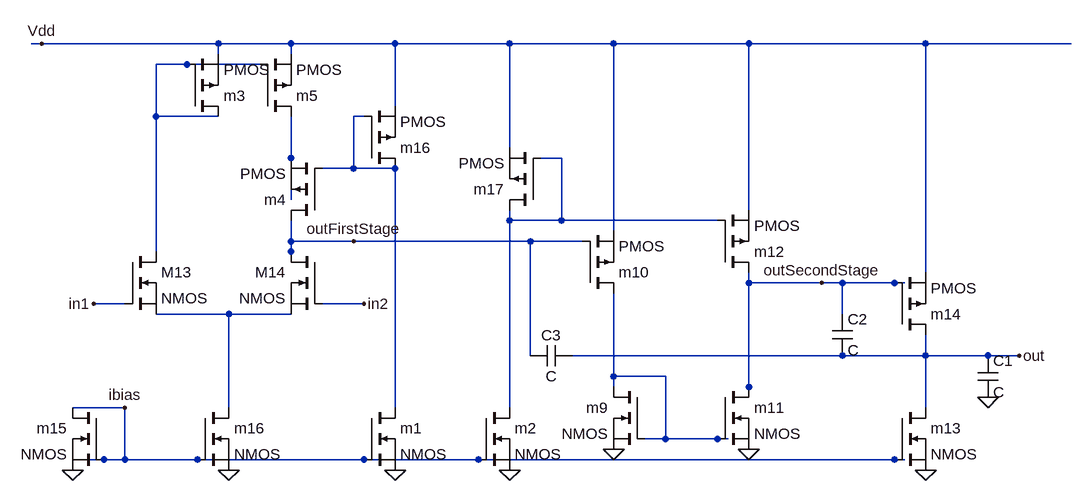
[diagram p0: schematic schematic_2.asc]
schematic_2.asc, the LTspice schematic file:
Version 4
SHEET 1 3804 1208
WIRE 1296 -144 1280 -144
WIRE 1568 -144 1296 -144
WIRE 1680 -144 1568 -144
WIRE 1840 -144 1680 -144
WIRE 2016 -144 1840 -144
WIRE 2176 -144 2016 -144
WIRE 2384 -144 2176 -144
WIRE 2656 -144 2384 -144
WIRE 2880 -144 2656 -144
WIRE 1568 -128 1568 -144
WIRE 1680 -128 1680 -144
WIRE 1520 -112 1472 -112
WIRE 1632 -112 1520 -112
WIRE 1840 -48 1840 -144
WIRE 1472 -32 1472 -112
WIRE 1568 -32 1472 -32
WIRE 1792 -32 1776 -32
WIRE 2016 16 2016 -144
WIRE 1680 32 1680 -32
WIRE 2096 32 2064 32
WIRE 1776 48 1776 -32
WIRE 1776 48 1728 48
WIRE 1840 48 1840 32
WIRE 1840 48 1776 48
WIRE 1680 96 1680 32
WIRE 2384 112 2384 -144
WIRE 2016 128 2016 112
WIRE 2096 128 2096 32
WIRE 2096 128 2016 128
WIRE 2336 128 2096 128
WIRE 2176 144 2176 -144
WIRE 1680 160 1680 128
WIRE 1776 160 1680 160
WIRE 2048 160 1776 160
WIRE 2128 160 2048 160
WIRE 1472 176 1472 -32
WIRE 1680 176 1680 160
WIRE 1680 192 1680 176
WIRE 2656 208 2656 -144
WIRE 2384 224 2384 208
WIRE 2496 224 2384 224
WIRE 2528 224 2496 224
WIRE 2608 224 2528 224
WIRE 2624 224 2608 224
WIRE 1424 256 1376 256
WIRE 1792 256 1728 256
WIRE 1584 272 1472 272
WIRE 1680 272 1584 272
WIRE 2528 272 2528 224
WIRE 2048 336 2048 160
WIRE 2528 336 2112 336
WIRE 2656 336 2656 304
WIRE 2656 336 2528 336
WIRE 2752 336 2656 336
WIRE 2800 336 2752 336
WIRE 2176 368 2176 240
WIRE 2256 368 2176 368
WIRE 2176 384 2176 368
WIRE 2384 384 2384 224
WIRE 2384 400 2384 384
WIRE 1424 416 1344 416
WIRE 1584 416 1584 272
WIRE 1840 416 1840 48
WIRE 2016 416 2016 128
WIRE 2656 416 2656 336
WIRE 2256 464 2256 368
WIRE 2256 464 2224 464
WIRE 2336 464 2256 464
WIRE 2352 464 2336 464
WIRE 1392 496 1344 496
WIRE 1424 496 1424 416
WIRE 1424 496 1392 496
WIRE 1536 496 1424 496
WIRE 1792 496 1536 496
WIRE 1968 496 1792 496
WIRE 2608 496 1968 496
WIRE 2624 496 2608 496
FLAG 2496 224 outSecondStage
FLAG 2800 336 out
FLAG 2656 512 0
FLAG 1376 256 in1
FLAG 1792 256 in2
FLAG 2176 480 0
FLAG 1776 160 outFirstStage
FLAG 1840 512 0
FLAG 2016 512 0
FLAG 2384 480 0
FLAG 1424 416 ibias
FLAG 1344 512 0
FLAG 1584 512 0
FLAG 2752 400 0
FLAG 1296 -144 Vdd
SYMBOL pmos 2608 304 M180
SYMATTR InstName m14
SYMBOL pmos 1728 128 R180
SYMATTR InstName m4
SYMBOL pmos 1520 -32 M180
SYMATTR InstName m3
SYMBOL pmos 1632 -32 M180
SYMATTR InstName m5
SYMBOL pmos 2064 112 R180
SYMATTR InstName m17
SYMBOL pmos 2128 240 M180
SYMATTR InstName m10
SYMBOL nmos 2608 416 R0
SYMATTR InstName m13
SYMBOL nmos 1424 176 R0
SYMATTR InstName M13
SYMBOL nmos 1728 176 M0
SYMATTR InstName M14
SYMBOL nmos 2224 384 M0
SYMATTR InstName m9
SYMBOL nmos 2336 384 R0
SYMATTR InstName m11
SYMBOL nmos 1392 416 M0
SYMATTR InstName m15
SYMBOL nmos 1536 416 R0
SYMATTR InstName m16
SYMBOL nmos 1968 416 R0
SYMATTR InstName m2
SYMBOL pmos 2336 208 M180
SYMATTR InstName m12
SYMBOL pmos 1792 48 M180
SYMATTR InstName m16
SYMBOL nmos 1792 416 R0
SYMATTR InstName m1
SYMBOL cap 2736 336 R0
SYMATTR InstName C1
SYMBOL cap 2512 272 R0
SYMATTR InstName C2
SYMBOL cap 2112 320 R90
WINDOW 0 0 32 VBottom 2
WINDOW 3 32 32 VTop 2
SYMATTR InstName C3

The netlist it stands for:
* schematic_2.asc
m14 out outSecondStage Vdd Vdd PMOS
m4 outFirstStage N002 N003 N003 PMOS
m3 N001 N001 Vdd Vdd PMOS
m5 N003 N001 Vdd Vdd PMOS
m17 N004 N004 Vdd Vdd PMOS
m10 N006 outFirstStage Vdd Vdd PMOS
m13 out ibias 0 0 NMOS
M13 N001 in1 N005 N005 NMOS
M14 outFirstStage in2 N005 N005 NMOS
m9 N006 N006 0 0 NMOS
m11 outSecondStage N006 0 0 NMOS
m15 ibias ibias 0 0 NMOS
m16 N005 ibias 0 0 NMOS
m2 N004 ibias 0 0 NMOS
m12 outSecondStage N004 Vdd Vdd PMOS
m16 N002 N002 Vdd Vdd PMOS
m1 N002 ibias 0 0 NMOS
C1 out 0 C
C2 outSecondStage out C
C3 out outFirstStage C
.model NMOS NMOS
.model PMOS PMOS
.lib standard.mos
.backanno
.end